# EAGLE schematic rel-regs (EAGLE 9.1.3)
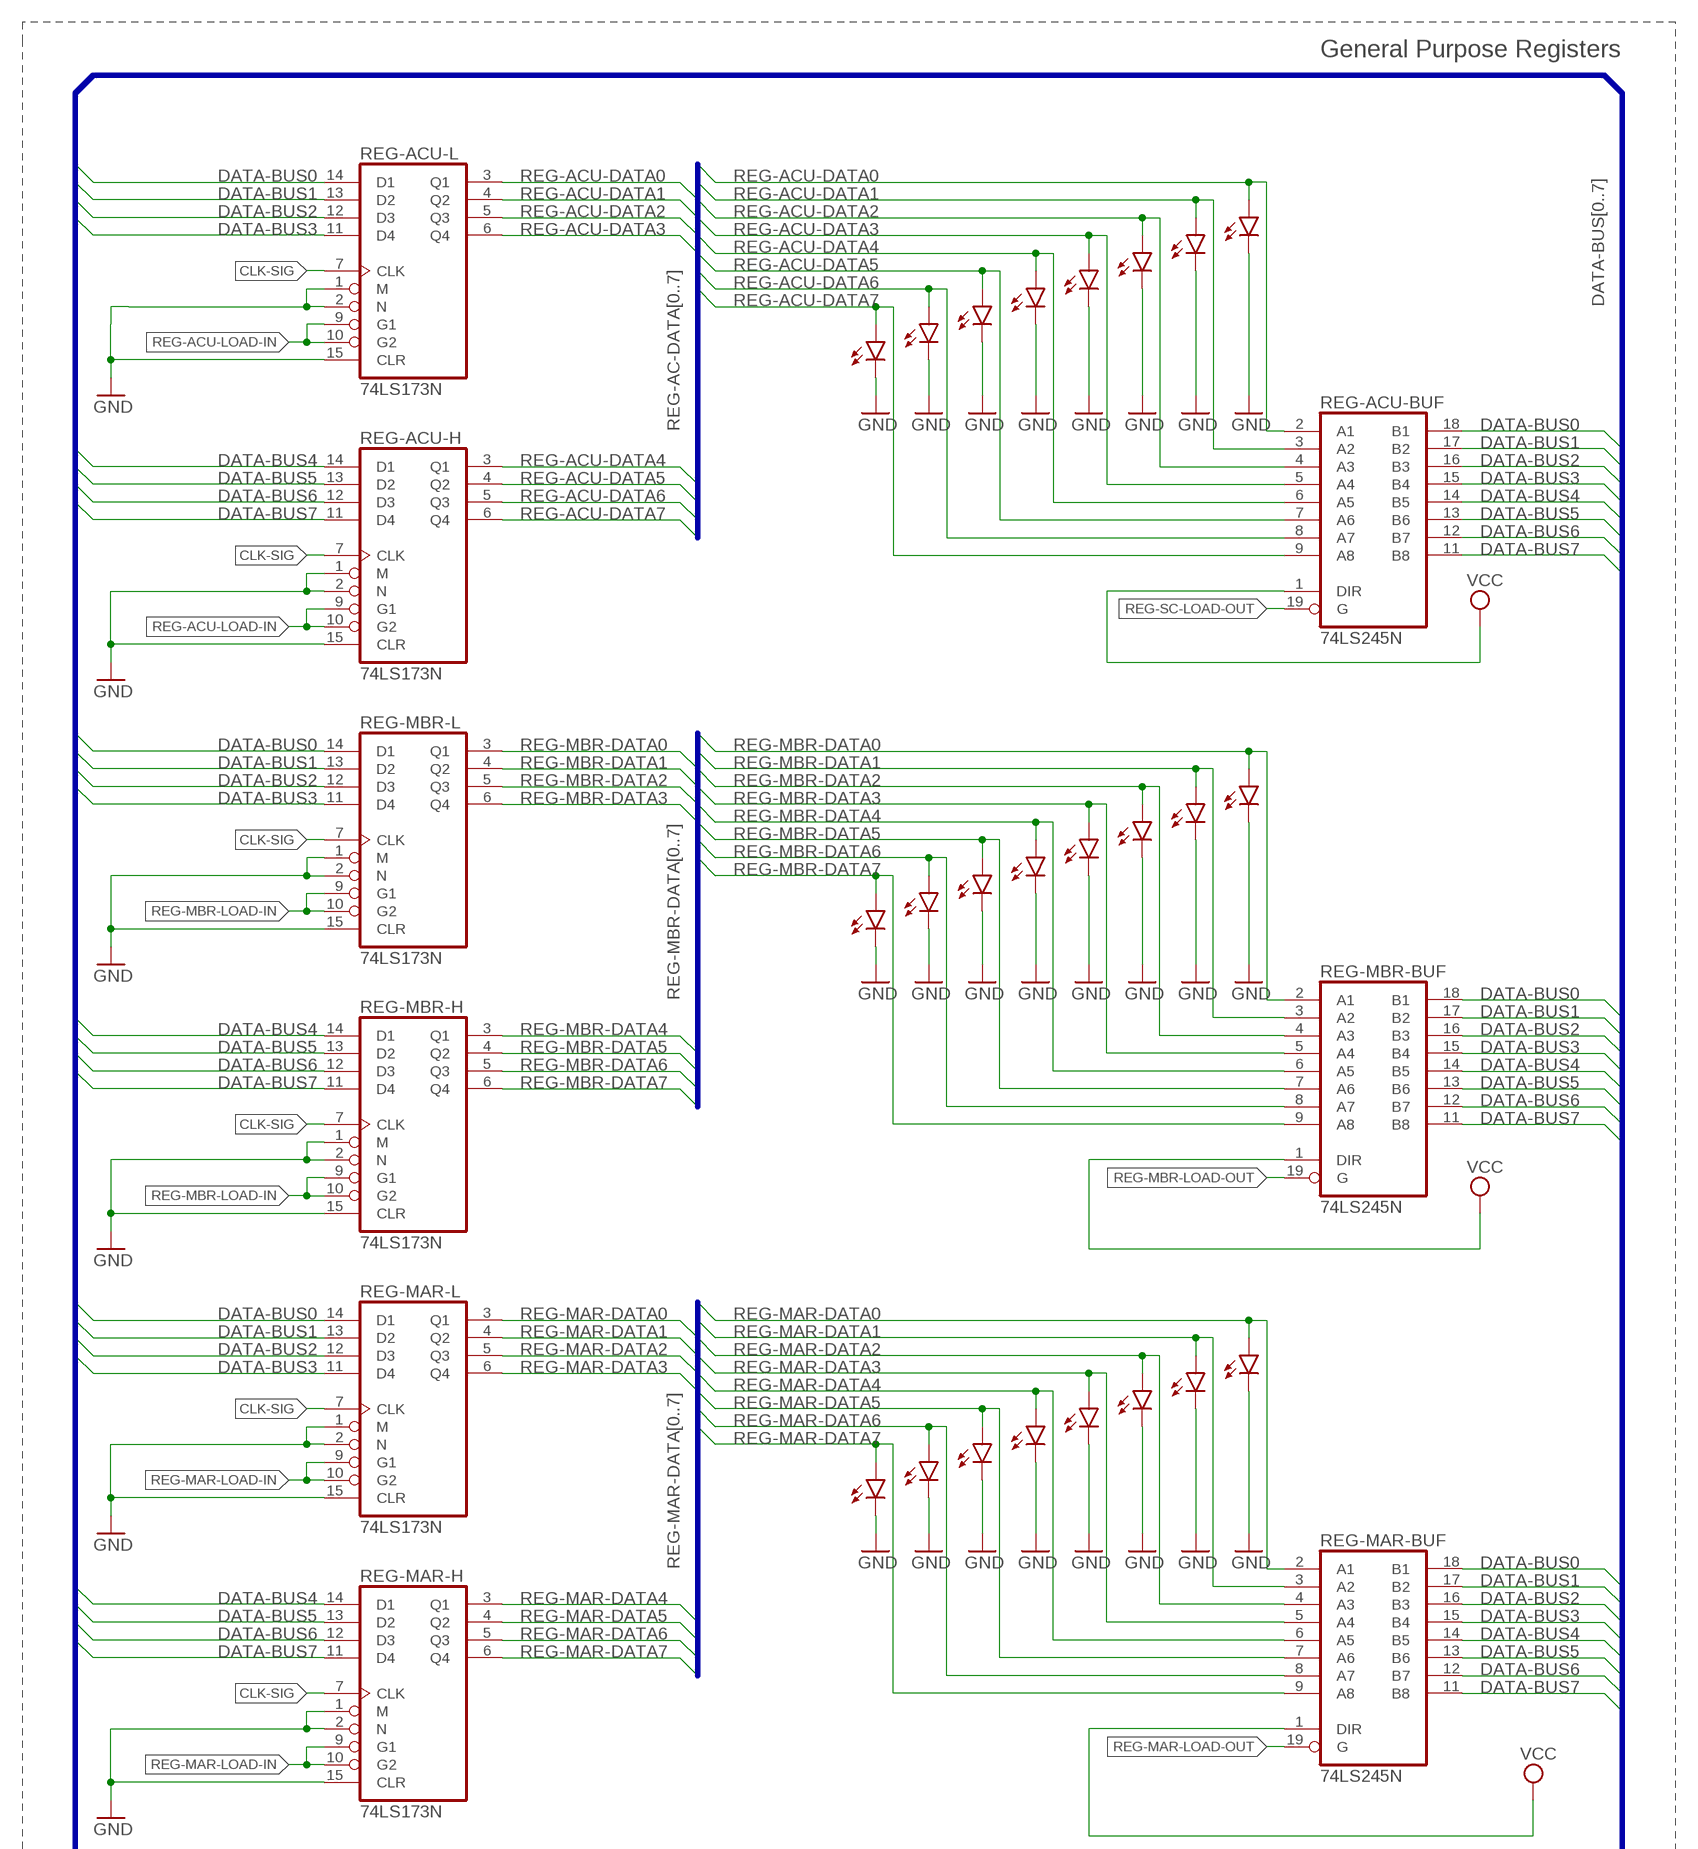
[diagram p0: schematic, sheet 1, part 1 of 2]
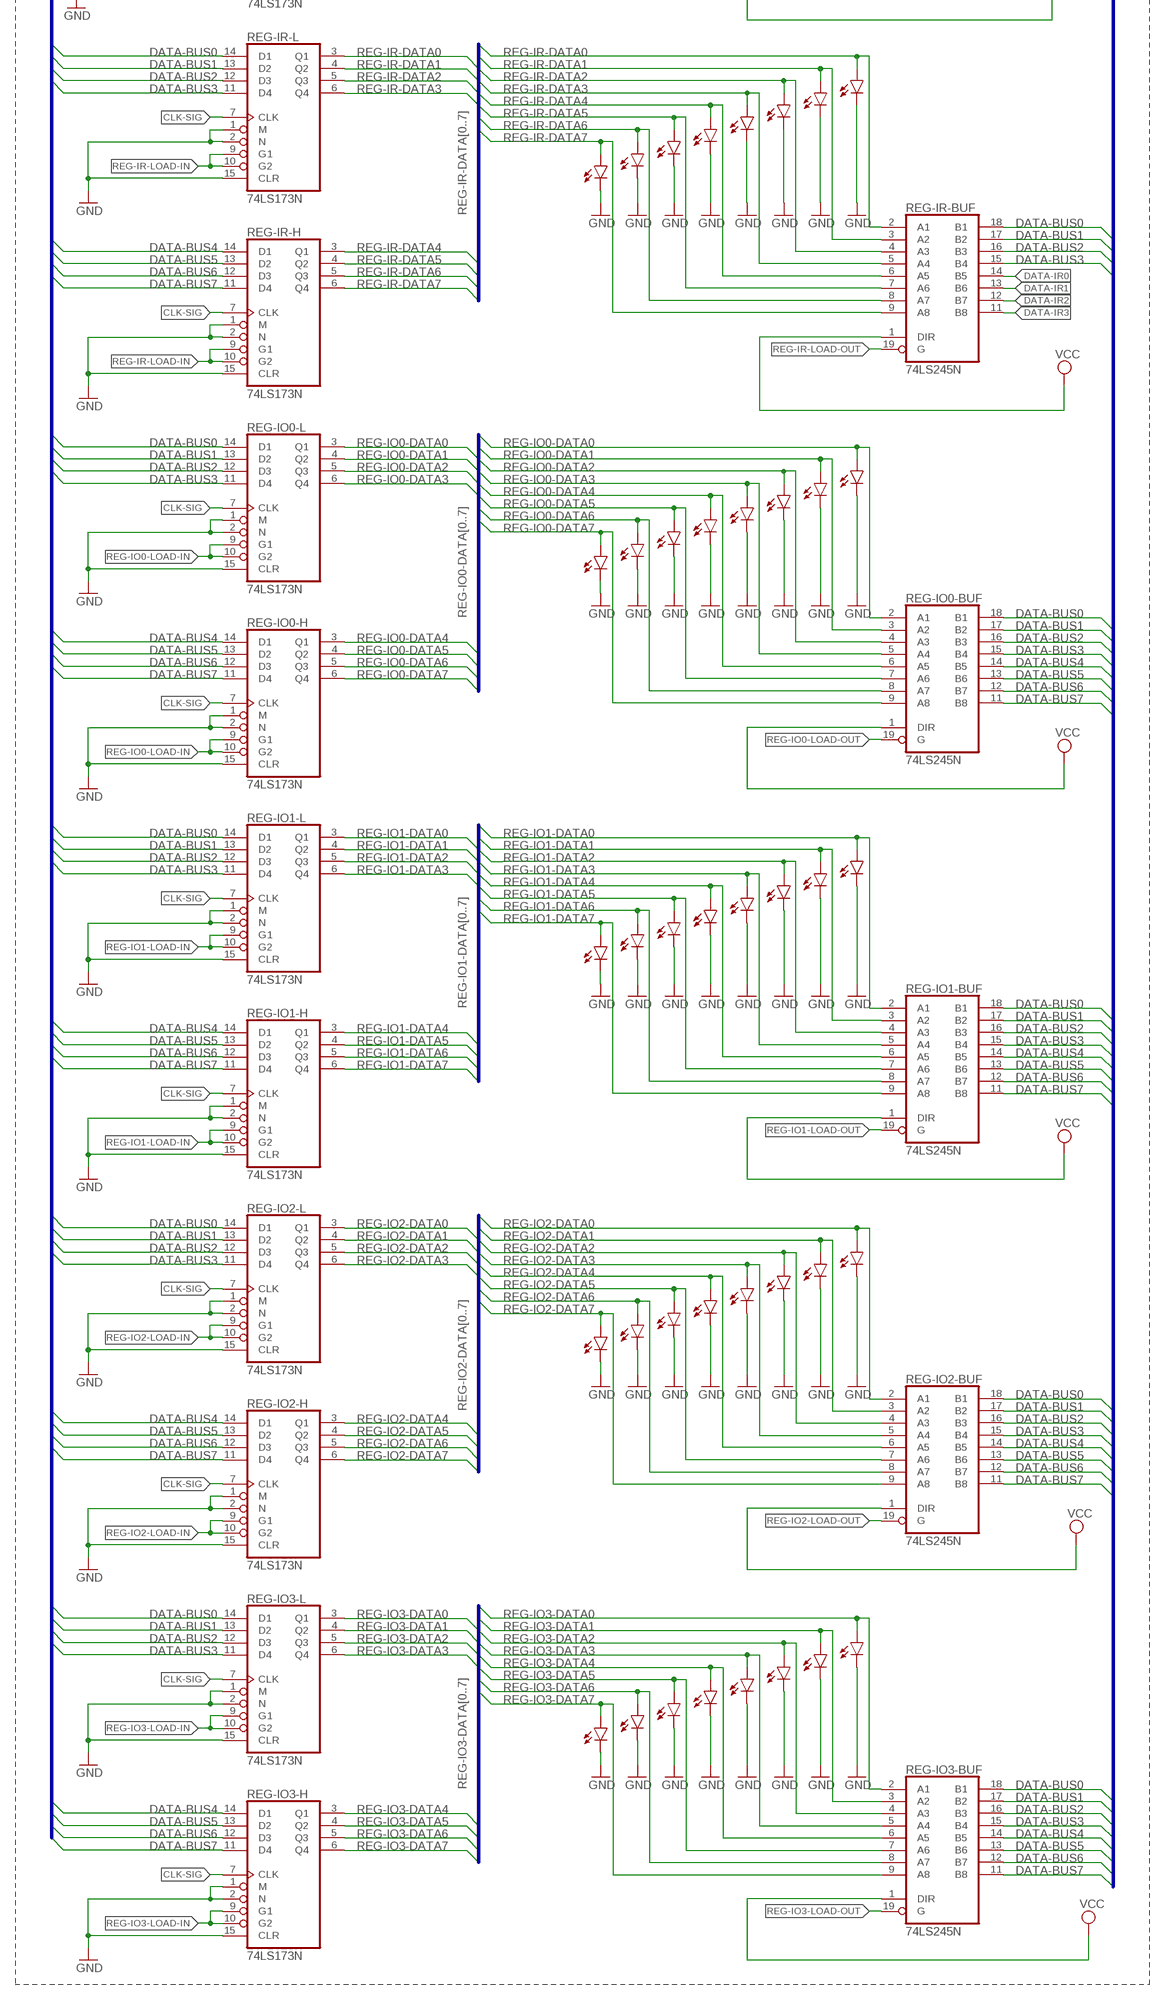
[diagram p1: schematic, sheet 1, part 2 of 2]

## Parts
LED0  LED5MM  [LED5MM]
LED1  LED5MM  [LED5MM]
LED2  LED5MM  [LED5MM]
LED3  LED5MM  [LED5MM]
LED4  LED5MM  [LED5MM]
LED5  LED5MM  [LED5MM]
LED6  LED5MM  [LED5MM]
LED7  LED5MM  [LED5MM]
LED8  LED5MM  [LED5MM]
LED9  LED5MM  [LED5MM]
LED10  LED5MM  [LED5MM]
LED11  LED5MM  [LED5MM]
LED12  LED5MM  [LED5MM]
LED13  LED5MM  [LED5MM]
LED14  LED5MM  [LED5MM]
LED15  LED5MM  [LED5MM]
LED16  LED5MM  [LED5MM]
LED17  LED5MM  [LED5MM]
LED18  LED5MM  [LED5MM]
LED19  LED5MM  [LED5MM]
LED20  LED5MM  [LED5MM]
LED21  LED5MM  [LED5MM]
LED22  LED5MM  [LED5MM]
LED23  LED5MM  [LED5MM]
LED24  LED5MM  [LED5MM]
LED25  LED5MM  [LED5MM]
LED26  LED5MM  [LED5MM]
LED27  LED5MM  [LED5MM]
LED28  LED5MM  [LED5MM]
LED29  LED5MM  [LED5MM]
LED30  LED5MM  [LED5MM]
LED31  LED5MM  [LED5MM]
LED32  LED5MM  [LED5MM]
LED33  LED5MM  [LED5MM]
LED34  LED5MM  [LED5MM]
LED35  LED5MM  [LED5MM]
LED36  LED5MM  [LED5MM]
LED37  LED5MM  [LED5MM]
LED38  LED5MM  [LED5MM]
LED39  LED5MM  [LED5MM]
LED40  LED5MM  [LED5MM]
LED41  LED5MM  [LED5MM]
LED42  LED5MM  [LED5MM]
LED43  LED5MM  [LED5MM]
LED44  LED5MM  [LED5MM]
LED45  LED5MM  [LED5MM]
LED46  LED5MM  [LED5MM]
LED47  LED5MM  [LED5MM]
LED48  LED5MM  [LED5MM]
LED49  LED5MM  [LED5MM]
LED50  LED5MM  [LED5MM]
LED51  LED5MM  [LED5MM]
LED52  LED5MM  [LED5MM]
LED53  LED5MM  [LED5MM]
LED54  LED5MM  [LED5MM]
LED55  LED5MM  [LED5MM]
LED56  LED5MM  [LED5MM]
LED57  LED5MM  [LED5MM]
LED58  LED5MM  [LED5MM]
LED59  LED5MM  [LED5MM]
LED60  LED5MM  [LED5MM]
LED61  LED5MM  [LED5MM]
LED62  LED5MM  [LED5MM]
LED63  LED5MM  [LED5MM]
REG-ACU-BUF  74LS245N  [DIL20]
REG-ACU-H  74LS173N  [DIL16]
REG-ACU-L  74LS173N  [DIL16]
REG-IO0-BUF  74LS245N  [DIL20]
REG-IO0-H  74LS173N  [DIL16]
REG-IO0-L  74LS173N  [DIL16]
REG-IO1-BUF  74LS245N  [DIL20]
REG-IO1-H  74LS173N  [DIL16]
REG-IO1-L  74LS173N  [DIL16]
REG-IO2-BUF  74LS245N  [DIL20]
REG-IO2-H  74LS173N  [DIL16]
REG-IO2-L  74LS173N  [DIL16]
REG-IO3-BUF  74LS245N  [DIL20]
REG-IO3-H  74LS173N  [DIL16]
REG-IO3-L  74LS173N  [DIL16]
REG-IR-BUF  74LS245N  [DIL20]
REG-IR-H  74LS173N  [DIL16]
REG-IR-L  74LS173N  [DIL16]
REG-MAR-BUF  74LS245N  [DIL20]
REG-MAR-H  74LS173N  [DIL16]
REG-MAR-L  74LS173N  [DIL16]
REG-MBR-BUF  74LS245N  [DIL20]
REG-MBR-H  74LS173N  [DIL16]
REG-MBR-L  74LS173N  [DIL16]

## Nets
CLK-SIG: REG-ACU-H.7(CLK) REG-ACU-L.7(CLK) REG-IO0-H.7(CLK) REG-IO0-L.7(CLK) REG-IO1-H.7(CLK) REG-IO1-L.7(CLK) REG-IO2-H.7(CLK) REG-IO2-L.7(CLK) REG-IO3-H.7(CLK) REG-IO3-L.7(CLK) REG-IR-H.7(CLK) REG-IR-L.7(CLK) REG-MAR-H.7(CLK) REG-MAR-L.7(CLK) REG-MBR-H.7(CLK) REG-MBR-L.7(CLK)
DATA-BUS0: REG-ACU-BUF.18(B1) REG-ACU-L.14(D1) REG-IO0-BUF.18(B1) REG-IO0-L.14(D1) REG-IO1-BUF.18(B1) REG-IO1-L.14(D1) REG-IO2-BUF.18(B1) REG-IO2-L.14(D1) REG-IO3-BUF.18(B1) REG-IO3-L.14(D1) REG-IR-BUF.18(B1) REG-IR-L.14(D1) REG-MAR-BUF.18(B1) REG-MAR-L.14(D1) REG-MBR-BUF.18(B1) REG-MBR-L.14(D1)
DATA-BUS1: REG-ACU-BUF.17(B2) REG-ACU-L.13(D2) REG-IO0-BUF.17(B2) REG-IO0-L.13(D2) REG-IO1-BUF.17(B2) REG-IO1-L.13(D2) REG-IO2-BUF.17(B2) REG-IO2-L.13(D2) REG-IO3-BUF.17(B2) REG-IO3-L.13(D2) REG-IR-BUF.17(B2) REG-IR-L.13(D2) REG-MAR-BUF.17(B2) REG-MAR-L.13(D2) REG-MBR-BUF.17(B2) REG-MBR-L.13(D2)
DATA-BUS2: REG-ACU-BUF.16(B3) REG-ACU-L.12(D3) REG-IO0-BUF.16(B3) REG-IO0-L.12(D3) REG-IO1-BUF.16(B3) REG-IO1-L.12(D3) REG-IO2-BUF.16(B3) REG-IO2-L.12(D3) REG-IO3-BUF.16(B3) REG-IO3-L.12(D3) REG-IR-BUF.16(B3) REG-IR-L.12(D3) REG-MAR-BUF.16(B3) REG-MAR-L.12(D3) REG-MBR-BUF.16(B3) REG-MBR-L.12(D3)
DATA-BUS3: REG-ACU-BUF.15(B4) REG-ACU-L.11(D4) REG-IO0-BUF.15(B4) REG-IO0-L.11(D4) REG-IO1-BUF.15(B4) REG-IO1-L.11(D4) REG-IO2-BUF.15(B4) REG-IO2-L.11(D4) REG-IO3-BUF.15(B4) REG-IO3-L.11(D4) REG-IR-BUF.15(B4) REG-IR-L.11(D4) REG-MAR-BUF.15(B4) REG-MAR-L.11(D4) REG-MBR-BUF.15(B4) REG-MBR-L.11(D4)
DATA-BUS4: REG-ACU-BUF.14(B5) REG-ACU-H.14(D1) REG-IO0-BUF.14(B5) REG-IO0-H.14(D1) REG-IO1-BUF.14(B5) REG-IO1-H.14(D1) REG-IO2-BUF.14(B5) REG-IO2-H.14(D1) REG-IO3-BUF.14(B5) REG-IO3-H.14(D1) REG-IR-H.14(D1) REG-MAR-BUF.14(B5) REG-MAR-H.14(D1) REG-MBR-BUF.14(B5) REG-MBR-H.14(D1)
DATA-BUS5: REG-ACU-BUF.13(B6) REG-ACU-H.13(D2) REG-IO0-BUF.13(B6) REG-IO0-H.13(D2) REG-IO1-BUF.13(B6) REG-IO1-H.13(D2) REG-IO2-BUF.13(B6) REG-IO2-H.13(D2) REG-IO3-BUF.13(B6) REG-IO3-H.13(D2) REG-IR-H.13(D2) REG-MAR-BUF.13(B6) REG-MAR-H.13(D2) REG-MBR-BUF.13(B6) REG-MBR-H.13(D2)
DATA-BUS6: REG-ACU-BUF.12(B7) REG-ACU-H.12(D3) REG-IO0-BUF.12(B7) REG-IO0-H.12(D3) REG-IO1-BUF.12(B7) REG-IO1-H.12(D3) REG-IO2-BUF.12(B7) REG-IO2-H.12(D3) REG-IO3-BUF.12(B7) REG-IO3-H.12(D3) REG-IR-H.12(D3) REG-MAR-BUF.12(B7) REG-MAR-H.12(D3) REG-MBR-BUF.12(B7) REG-MBR-H.12(D3)
DATA-BUS7: REG-ACU-BUF.11(B8) REG-ACU-H.11(D4) REG-IO0-BUF.11(B8) REG-IO0-H.11(D4) REG-IO1-BUF.11(B8) REG-IO1-H.11(D4) REG-IO2-BUF.11(B8) REG-IO2-H.11(D4) REG-IO3-BUF.11(B8) REG-IO3-H.11(D4) REG-IR-H.11(D4) REG-MAR-BUF.11(B8) REG-MAR-H.11(D4) REG-MBR-BUF.11(B8) REG-MBR-H.11(D4)
DATA-IR0: REG-IR-BUF.14(B5)
DATA-IR1: REG-IR-BUF.13(B6)
DATA-IR2: REG-IR-BUF.12(B7)
DATA-IR3: REG-IR-BUF.11(B8)
GND: LED0.K(C) LED1.K(C) LED2.K(C) LED3.K(C) LED4.K(C) LED5.K(C) LED6.K(C) LED7.K(C) LED8.K(C) LED9.K(C) LED10.K(C) LED11.K(C) LED12.K(C) LED13.K(C) LED14.K(C) LED15.K(C) LED16.K(C) LED17.K(C) LED18.K(C) LED19.K(C) LED20.K(C) LED21.K(C) LED22.K(C) LED23.K(C) LED24.K(C) LED25.K(C) LED26.K(C) LED27.K(C) LED28.K(C) LED29.K(C) LED30.K(C) LED31.K(C) LED32.K(C) LED33.K(C) LED34.K(C) LED35.K(C) LED36.K(C) LED37.K(C) LED38.K(C) LED39.K(C) LED40.K(C) LED41.K(C) LED42.K(C) LED43.K(C) LED44.K(C) LED45.K(C) LED46.K(C) LED47.K(C) LED48.K(C) LED49.K(C) LED50.K(C) LED51.K(C) LED52.K(C) LED53.K(C) LED54.K(C) LED55.K(C) LED56.K(C) LED57.K(C) LED58.K(C) LED59.K(C) LED60.K(C) LED61.K(C) LED62.K(C) LED63.K(C) REG-ACU-H.1(M) REG-ACU-H.2(N) REG-ACU-H.15(CLR) REG-ACU-L.1(M) REG-ACU-L.2(N) REG-ACU-L.15(CLR) REG-IO0-H.1(M) REG-IO0-H.2(N) REG-IO0-H.15(CLR) REG-IO0-L.1(M) REG-IO0-L.2(N) REG-IO0-L.15(CLR) REG-IO1-H.1(M) REG-IO1-H.2(N) REG-IO1-H.15(CLR) REG-IO1-L.1(M) REG-IO1-L.2(N) REG-IO1-L.15(CLR) REG-IO2-H.1(M) REG-IO2-H.2(N) REG-IO2-H.15(CLR) REG-IO2-L.1(M) REG-IO2-L.2(N) REG-IO2-L.15(CLR) REG-IO3-H.1(M) REG-IO3-H.2(N) REG-IO3-H.15(CLR) REG-IO3-L.1(M) REG-IO3-L.2(N) REG-IO3-L.15(CLR) REG-IR-H.1(M) REG-IR-H.2(N) REG-IR-H.15(CLR) REG-IR-L.1(M) REG-IR-L.2(N) REG-IR-L.15(CLR) REG-MAR-H.1(M) REG-MAR-H.2(N) REG-MAR-H.15(CLR) REG-MAR-L.1(M) REG-MAR-L.2(N) REG-MAR-L.15(CLR) REG-MBR-H.1(M) REG-MBR-H.2(N) REG-MBR-H.15(CLR) REG-MBR-L.1(M) REG-MBR-L.2(N) REG-MBR-L.15(CLR)
REG-ACU-DATA0: LED0.A REG-ACU-BUF.2(A1) REG-ACU-L.3(Q1)
REG-ACU-DATA1: LED1.A REG-ACU-BUF.3(A2) REG-ACU-L.4(Q2)
REG-ACU-DATA2: LED2.A REG-ACU-BUF.4(A3) REG-ACU-L.5(Q3)
REG-ACU-DATA3: LED3.A REG-ACU-BUF.5(A4) REG-ACU-L.6(Q4)
REG-ACU-DATA4: LED4.A REG-ACU-BUF.6(A5) REG-ACU-H.3(Q1)
REG-ACU-DATA5: LED5.A REG-ACU-BUF.7(A6) REG-ACU-H.4(Q2)
REG-ACU-DATA6: LED6.A REG-ACU-BUF.8(A7) REG-ACU-H.5(Q3)
REG-ACU-DATA7: LED7.A REG-ACU-BUF.9(A8) REG-ACU-H.6(Q4)
REG-ACU-LOAD-IN: REG-ACU-H.9(G1) REG-ACU-H.10(G2) REG-ACU-L.9(G1) REG-ACU-L.10(G2)
REG-IO0-DATA0: LED32.A REG-IO0-BUF.2(A1) REG-IO0-L.3(Q1)
REG-IO0-DATA1: LED33.A REG-IO0-BUF.3(A2) REG-IO0-L.4(Q2)
REG-IO0-DATA2: LED34.A REG-IO0-BUF.4(A3) REG-IO0-L.5(Q3)
REG-IO0-DATA3: LED35.A REG-IO0-BUF.5(A4) REG-IO0-L.6(Q4)
REG-IO0-DATA4: LED36.A REG-IO0-BUF.6(A5) REG-IO0-H.3(Q1)
REG-IO0-DATA5: LED37.A REG-IO0-BUF.7(A6) REG-IO0-H.4(Q2)
REG-IO0-DATA6: LED38.A REG-IO0-BUF.8(A7) REG-IO0-H.5(Q3)
REG-IO0-DATA7: LED39.A REG-IO0-BUF.9(A8) REG-IO0-H.6(Q4)
REG-IO0-LOAD-IN: REG-IO0-H.9(G1) REG-IO0-H.10(G2) REG-IO0-L.9(G1) REG-IO0-L.10(G2)
REG-IO0-LOAD-OUT: REG-IO0-BUF.19(G)
REG-IO1-DATA0: LED40.A REG-IO1-BUF.2(A1) REG-IO1-L.3(Q1)
REG-IO1-DATA1: LED41.A REG-IO1-BUF.3(A2) REG-IO1-L.4(Q2)
REG-IO1-DATA2: LED42.A REG-IO1-BUF.4(A3) REG-IO1-L.5(Q3)
REG-IO1-DATA3: LED43.A REG-IO1-BUF.5(A4) REG-IO1-L.6(Q4)
REG-IO1-DATA4: LED44.A REG-IO1-BUF.6(A5) REG-IO1-H.3(Q1)
REG-IO1-DATA5: LED45.A REG-IO1-BUF.7(A6) REG-IO1-H.4(Q2)
REG-IO1-DATA6: LED46.A REG-IO1-BUF.8(A7) REG-IO1-H.5(Q3)
REG-IO1-DATA7: LED47.A REG-IO1-BUF.9(A8) REG-IO1-H.6(Q4)
REG-IO1-LOAD-IN: REG-IO1-H.9(G1) REG-IO1-H.10(G2) REG-IO1-L.9(G1) REG-IO1-L.10(G2)
REG-IO1-LOAD-OUT: REG-IO1-BUF.19(G)
REG-IO2-DATA0: LED48.A REG-IO2-BUF.2(A1) REG-IO2-L.3(Q1)
REG-IO2-DATA1: LED49.A REG-IO2-BUF.3(A2) REG-IO2-L.4(Q2)
REG-IO2-DATA2: LED50.A REG-IO2-BUF.4(A3) REG-IO2-L.5(Q3)
REG-IO2-DATA3: LED51.A REG-IO2-BUF.5(A4) REG-IO2-L.6(Q4)
REG-IO2-DATA4: LED52.A REG-IO2-BUF.6(A5) REG-IO2-H.3(Q1)
REG-IO2-DATA5: LED53.A REG-IO2-BUF.7(A6) REG-IO2-H.4(Q2)
REG-IO2-DATA6: LED54.A REG-IO2-BUF.8(A7) REG-IO2-H.5(Q3)
REG-IO2-DATA7: LED55.A REG-IO2-BUF.9(A8) REG-IO2-H.6(Q4)
REG-IO2-LOAD-IN: REG-IO2-H.9(G1) REG-IO2-H.10(G2) REG-IO2-L.9(G1) REG-IO2-L.10(G2)
REG-IO2-LOAD-OUT: REG-IO2-BUF.19(G)
REG-IO3-DATA0: LED56.A REG-IO3-BUF.2(A1) REG-IO3-L.3(Q1)
REG-IO3-DATA1: LED57.A REG-IO3-BUF.3(A2) REG-IO3-L.4(Q2)
REG-IO3-DATA2: LED58.A REG-IO3-BUF.4(A3) REG-IO3-L.5(Q3)
REG-IO3-DATA3: LED59.A REG-IO3-BUF.5(A4) REG-IO3-L.6(Q4)
REG-IO3-DATA4: LED60.A REG-IO3-BUF.6(A5) REG-IO3-H.3(Q1)
REG-IO3-DATA5: LED61.A REG-IO3-BUF.7(A6) REG-IO3-H.4(Q2)
REG-IO3-DATA6: LED62.A REG-IO3-BUF.8(A7) REG-IO3-H.5(Q3)
REG-IO3-DATA7: LED63.A REG-IO3-BUF.9(A8) REG-IO3-H.6(Q4)
REG-IO3-LOAD-IN: REG-IO3-H.9(G1) REG-IO3-H.10(G2) REG-IO3-L.9(G1) REG-IO3-L.10(G2)
REG-IO3-LOAD-OUT: REG-IO3-BUF.19(G)
REG-IR-DATA0: LED24.A REG-IR-BUF.2(A1) REG-IR-L.3(Q1)
REG-IR-DATA1: LED25.A REG-IR-BUF.3(A2) REG-IR-L.4(Q2)
REG-IR-DATA2: LED26.A REG-IR-BUF.4(A3) REG-IR-L.5(Q3)
REG-IR-DATA3: LED27.A REG-IR-BUF.5(A4) REG-IR-L.6(Q4)
REG-IR-DATA4: LED28.A REG-IR-BUF.6(A5) REG-IR-H.3(Q1)
REG-IR-DATA5: LED29.A REG-IR-BUF.7(A6) REG-IR-H.4(Q2)
REG-IR-DATA6: LED30.A REG-IR-BUF.8(A7) REG-IR-H.5(Q3)
REG-IR-DATA7: LED31.A REG-IR-BUF.9(A8) REG-IR-H.6(Q4)
REG-IR-LOAD-IN: REG-IR-H.9(G1) REG-IR-H.10(G2) REG-IR-L.9(G1) REG-IR-L.10(G2)
REG-IR-LOAD-OUT: REG-IR-BUF.19(G)
REG-MAR-DATA0: LED16.A REG-MAR-BUF.2(A1) REG-MAR-L.3(Q1)
REG-MAR-DATA1: LED17.A REG-MAR-BUF.3(A2) REG-MAR-L.4(Q2)
REG-MAR-DATA2: LED18.A REG-MAR-BUF.4(A3) REG-MAR-L.5(Q3)
REG-MAR-DATA3: LED19.A REG-MAR-BUF.5(A4) REG-MAR-L.6(Q4)
REG-MAR-DATA4: LED20.A REG-MAR-BUF.6(A5) REG-MAR-H.3(Q1)
REG-MAR-DATA5: LED21.A REG-MAR-BUF.7(A6) REG-MAR-H.4(Q2)
REG-MAR-DATA6: LED22.A REG-MAR-BUF.8(A7) REG-MAR-H.5(Q3)
REG-MAR-DATA7: LED23.A REG-MAR-BUF.9(A8) REG-MAR-H.6(Q4)
REG-MAR-LOAD-IN: REG-MAR-H.9(G1) REG-MAR-H.10(G2) REG-MAR-L.9(G1) REG-MAR-L.10(G2)
REG-MAR-LOAD-OUT: REG-MAR-BUF.19(G)
REG-MBR-DATA0: LED8.A REG-MBR-BUF.2(A1) REG-MBR-L.3(Q1)
REG-MBR-DATA1: LED9.A REG-MBR-BUF.3(A2) REG-MBR-L.4(Q2)
REG-MBR-DATA2: LED10.A REG-MBR-BUF.4(A3) REG-MBR-L.5(Q3)
REG-MBR-DATA3: LED11.A REG-MBR-BUF.5(A4) REG-MBR-L.6(Q4)
REG-MBR-DATA4: LED12.A REG-MBR-BUF.6(A5) REG-MBR-H.3(Q1)
REG-MBR-DATA5: LED13.A REG-MBR-BUF.7(A6) REG-MBR-H.4(Q2)
REG-MBR-DATA6: LED14.A REG-MBR-BUF.8(A7) REG-MBR-H.5(Q3)
REG-MBR-DATA7: LED15.A REG-MBR-BUF.9(A8) REG-MBR-H.6(Q4)
REG-MBR-LOAD-IN: REG-MBR-H.9(G1) REG-MBR-H.10(G2) REG-MBR-L.9(G1) REG-MBR-L.10(G2)
REG-MBR-LOAD-OUT: REG-MBR-BUF.19(G)
REG-SC-LOAD-OUT: REG-ACU-BUF.19(G)
VCC: REG-ACU-BUF.1(DIR) REG-IO0-BUF.1(DIR) REG-IO1-BUF.1(DIR) REG-IO2-BUF.1(DIR) REG-IO3-BUF.1(DIR) REG-IR-BUF.1(DIR) REG-MAR-BUF.1(DIR) REG-MBR-BUF.1(DIR)

## Buses
REG-AC-DATA[0..7]
DATA-BUS[0..7]
REG-MBR-DATA[0..7]
REG-MAR-DATA[0..7]
REG-IR-DATA[0..7]
REG-IO0-DATA[0..7]
REG-IO1-DATA[0..7]
REG-IO2-DATA[0..7]
REG-IO3-DATA[0..7]

## Notes on the sheet
- General Purpose Registers

## Power pins joined to a net without a drawn wire
GND: REG-ACU-BUF.10(GND) REG-ACU-H.8(GND) REG-ACU-L.8(GND) REG-IO0-BUF.10(GND) REG-IO0-H.8(GND) REG-IO0-L.8(GND) REG-IO1-BUF.10(GND) REG-IO1-H.8(GND) REG-IO1-L.8(GND) REG-IO2-BUF.10(GND) REG-IO2-H.8(GND) REG-IO2-L.8(GND) REG-IO3-BUF.10(GND) REG-IO3-H.8(GND) REG-IO3-L.8(GND) REG-IR-BUF.10(GND) REG-IR-H.8(GND) REG-IR-L.8(GND) REG-MAR-BUF.10(GND) REG-MAR-H.8(GND) REG-MAR-L.8(GND) REG-MBR-BUF.10(GND) REG-MBR-H.8(GND) REG-MBR-L.8(GND)
VCC: REG-ACU-BUF.20(VCC) REG-ACU-H.16(VCC) REG-ACU-L.16(VCC) REG-IO0-BUF.20(VCC) REG-IO0-H.16(VCC) REG-IO0-L.16(VCC) REG-IO1-BUF.20(VCC) REG-IO1-H.16(VCC) REG-IO1-L.16(VCC) REG-IO2-BUF.20(VCC) REG-IO2-H.16(VCC) REG-IO2-L.16(VCC) REG-IO3-BUF.20(VCC) REG-IO3-H.16(VCC) REG-IO3-L.16(VCC) REG-IR-BUF.20(VCC) REG-IR-H.16(VCC) REG-IR-L.16(VCC) REG-MAR-BUF.20(VCC) REG-MAR-H.16(VCC) REG-MAR-L.16(VCC) REG-MBR-BUF.20(VCC) REG-MBR-H.16(VCC) REG-MBR-L.16(VCC)

## Library data of the parts
LED0 LED1-LED63 = led:LED: LED OSRAM: - CHIPLED LG R971, LG N971, LY N971, LG Q971, LY Q971, LO R971, LY R971 LH N974, LH R974 LS Q976, LO Q976, LY Q976 LO Q996 - Hyper CHIPLED LW Q18S LB Q993, LB Q99A, LB R99A - SideLED LS A670, LO A670, LY A670, LG A670, LP A670 LB A673, LV A673, LT A673, LW A673 LH A674 LY A675 LS A676, LA A676, LO A676, LY A676, LW A676 LS A679, LY A679, LG A679 - Hyper Micro SIDELED® LS Y876, LA Y876, LO Y876, LY Y876 LT Y87S - SmartLED LW L88C, LW L88S LB L89C, LB L89S, LG L890 LS L89K, LO L89K, LY L89K LS L896, LA L896, LO L896, LY L896 - TOPLED LS T670, LO T670, LY T670, LG T670, LP T670 LSG T670, LSP T670, LSY T670, LOP T670, LYG T670 LG T671, LOG T671, LSG T671 LB T673, LV T673, LT T673, LW T673 LH T674 LS T676, LA T676, LO T676, LY T676, LB T676, LH T676, LSB T676, LW T676 LB T67C, LV T67C, LT T67C, LS T67K, LO T67K, LY T67K, LW E67C LS E67B, LA E67B, LO E67B, LY E67B, LB E67C, LV E67C, LT E67C LW T67C LS T679, LY T679, LG T679 LS T770, LO T770, LY T770, LG T770, LP T770 LB T773, LV T773, LT T773, LW T773 LH T774 LS E675, LA E675, LY E675, LS T675 LS T776, LA T776, LO T776, LY T776, LB T776 LHGB T686 LT T68C, LB T68C - Hyper Mini TOPLED® LB M676 - Mini TOPLED Santana® LG M470 LS M47K, LO M47K, LY M47K Source: http://www.osram.convergy.de LUXEON: - LUMILED® LXK2-PW12-R00, LXK2-PW12-S00, LXK2-PW14-U00, LXK2-PW14-V00 LXK2-PM12-R00, LXK2-PM12-S00, LXK2-PM14-U00 LXK2-PE12-Q00, LXK2-PE12-R00, LXK2-PE12-S00, LXK2-PE14-T00, LXK2-PE14-U00 LXK2-PB12-K00, LXK2-PB12-L00, LXK2-PB12-M00, LXK2-PB14-N00, LXK2-PB14-P00, LXK2-PB14-Q00 LXK2-PR12-L00, LXK2-PR12-M00, LXK2-PR14-Q00, LXK2-PR14-R00 LXK2-PD12-Q00, LXK2-PD12-R00, LXK2-PD12-S00 LXK2-PH12-R00, LXK2-PH12-S00 LXK2-PL12-P00, LXK2-PL12-Q00, LXK2-PL12-R00 Source: www.luxeon.com KINGBRIGHT: KA-3528ASYC Source: www.kingbright.com
REG-ACU-BUF REG-IO0-BUF REG-IO1-BUF REG-IO2-BUF REG-IO3-BUF REG-IR-BUF REG-MAR-BUF REG-MBR-BUF = 74xx-eu:74*245: Octal BUS TRANSCEIVER, 3-state
REG-ACU-H REG-ACU-L REG-IO0-H REG-IO0-L REG-IO1-H REG-IO1-L REG-IO2-H REG-IO2-L REG-IO3-H REG-IO3-L REG-IR-H REG-IR-L REG-MAR-H REG-MAR-L REG-MBR-H REG-MBR-L = 74xx-eu:74*173: 4-bit D type REGISTER, 3-state